# EAGLE design Qwiic Twist (EAGLE 9.4.0)
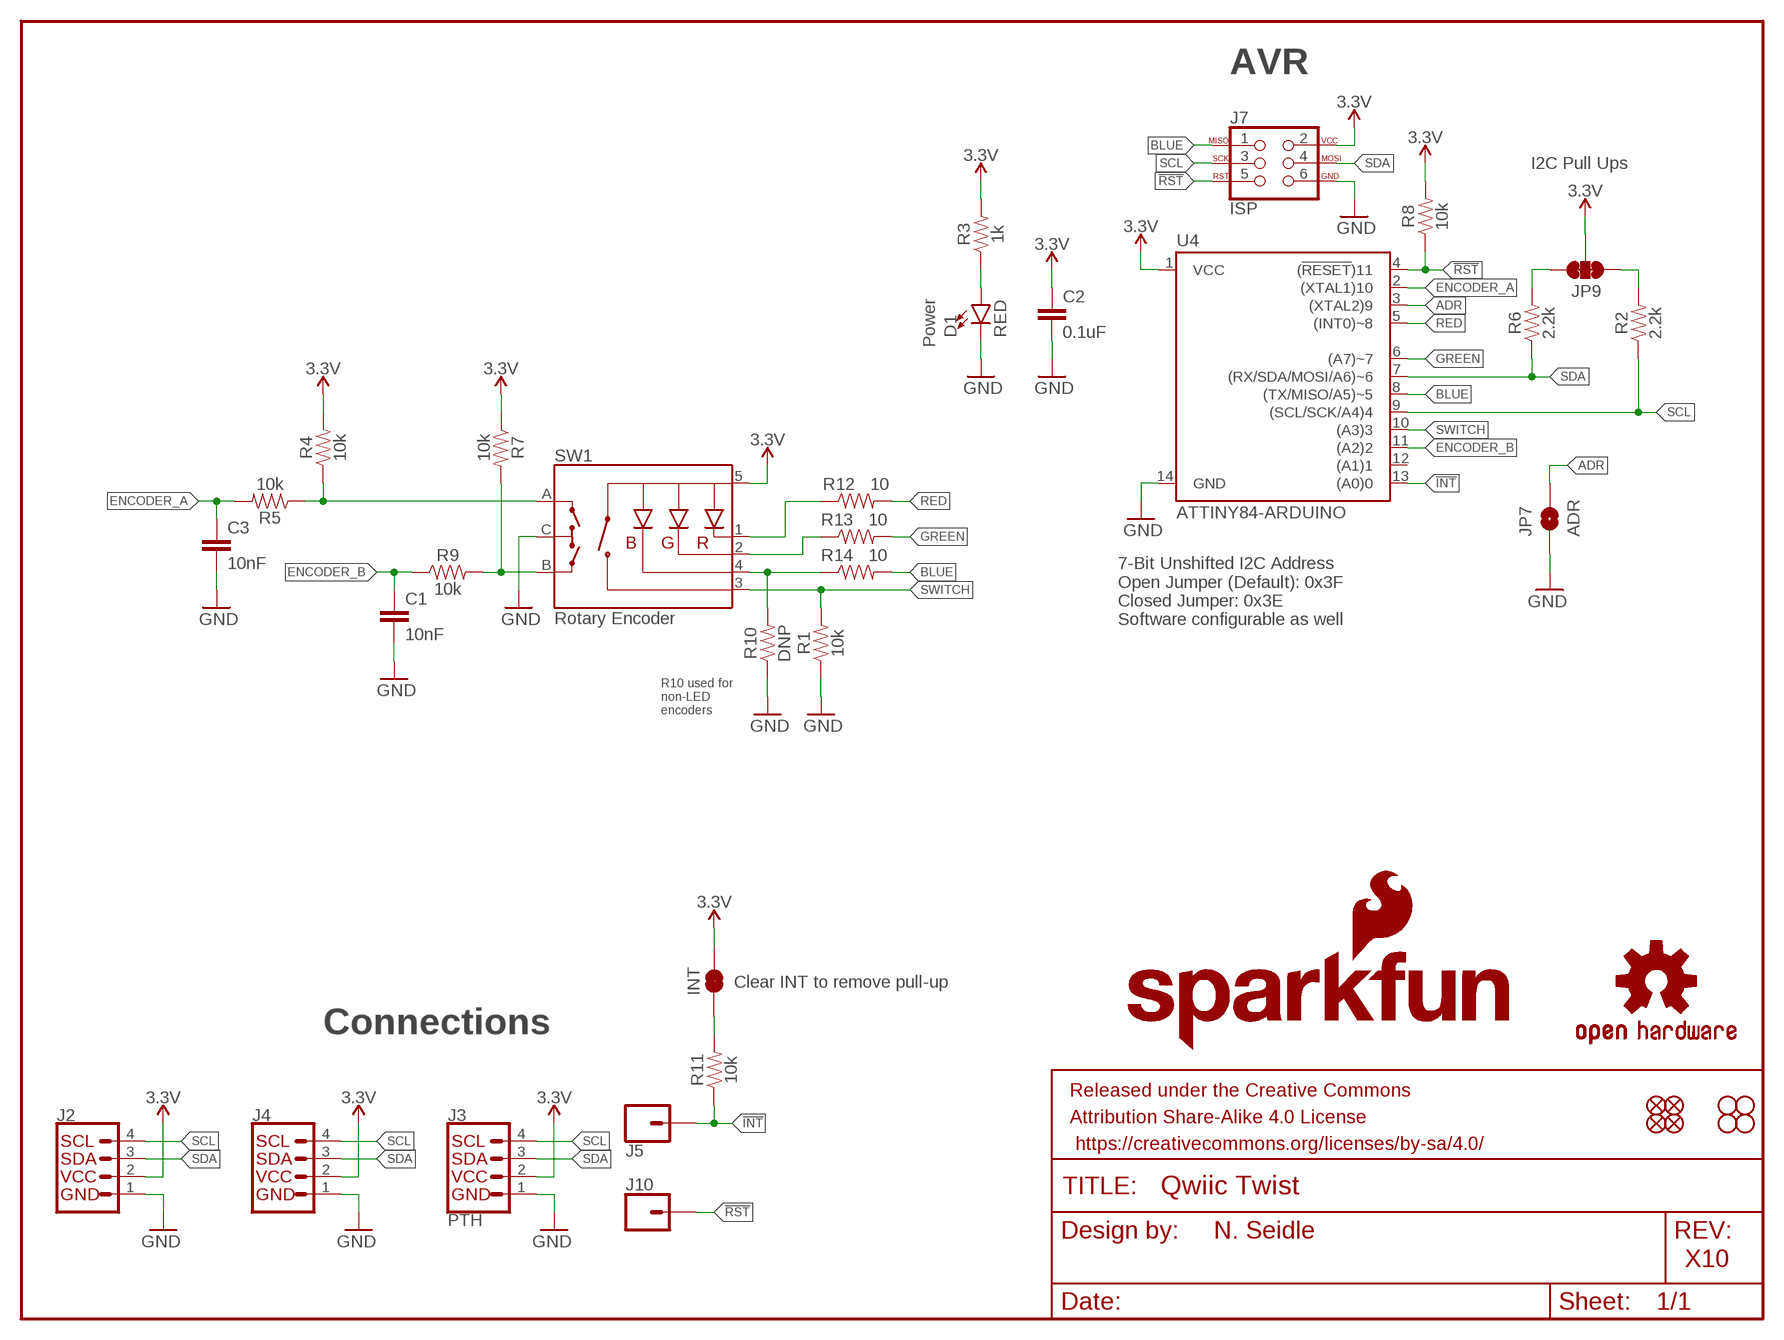
[diagram p0: schematic, sheet 1]

## Parts
C1  10nF  10NF-0603-50V-10%  [0603]
C2  0.1uF  0.1UF-0603-25V-(+80/-20%)  [0603]
C3  10nF  10NF-0603-50V-10%  [0603]
D1  RED  LED-RED0603  [LED-0603]
FRAME1  FRAME-LETTER  [CREATIVE_COMMONS]
INT  JUMPER-SMT_2_NC_TRACE_SILK  [SMT-JUMPER_2_NC_TRACE_SILK]
J2  QWIIC_CONNECTORJS-1MM  [1X04_1MM_RA]
J3  PTH  I2C_STANDARD_NO_SILK  [1X04_NO_SILK]
J4  QWIIC_CONNECTORJS-1MM  [1X04_1MM_RA]
J5  CONN_01PTH_NO_SILK_YES_STOP  [1X01_NO_SILK]
J7  ISP  AVR_SPI_PROG_3X2TESTPOINTS  [2X3_TEST_POINTS]
J10  CONN_01PTH_NO_SILK_YES_STOP  [1X01_NO_SILK]
JP1  FIDUCIALUFIDUCIAL  [MICRO-FIDUCIAL]
JP2  FIDUCIALUFIDUCIAL  [MICRO-FIDUCIAL]
JP3  STAND-OFF  [STAND-OFF]
JP4  STAND-OFF  [STAND-OFF]
JP5  FIDUCIALUFIDUCIAL  [MICRO-FIDUCIAL]
JP6  FIDUCIALUFIDUCIAL  [MICRO-FIDUCIAL]
JP7  ADR  JUMPER-SMT_2_NO_SILK  [SMT-JUMPER_2_NO_SILK]
JP9  JUMPER-SMT_3_2-NC_TRACE_SILK  [SMT-JUMPER_3_2-NC_TRACE_SILK]
JP11  STAND-OFF  [STAND-OFF]
JP13  STAND-OFF  [STAND-OFF]
LOGO1  OSHW-LOGOMINI  [OSHW-LOGO-MINI]
LOGO2  SFE_LOGO_NAME_FLAME.1_INCH  [SFE_LOGO_NAME_FLAME_.1]
LOGO3  SFE_LOGO_FLAME.1EXP  [SFE_LOGO_FLAME_COPPER_EXPOSED_.1]
R1  10k  10KOHM-0603-1/10W-1%  [0603]
R2  2.2k  2.2KOHM-0603-1/10W-1%  [0603]
R3  1k  1KOHM-0603-1/10W-1%  [0603]
R4  10k  10KOHM-0603-1/10W-1%  [0603]
R5  10k  10KOHM-0603-1/10W-1%  [0603]
R6  2.2k  2.2KOHM-0603-1/10W-1%  [0603]
R7  10k  10KOHM-0603-1/10W-1%  [0603]
R8  10k  10KOHM-0603-1/10W-1%  [0603]
R9  10k  10KOHM-0603-1/10W-1%  [0603]
R10  DNP  10KOHM-0603-1/10W-1%  [0603]
R11  10k  10KOHM-0603-1/10W-1%  [0603]
R12  10  10OHM-0603-1/10W-1%  [0603]
R13  10  10OHM-0603-1/10W-1%  [0603]
R14  10  10OHM-0603-1/10W-1%  [0603]
SW1  Rotary Encoder  ENCODER-RGB-SWITCHKIT  [ENCODER_LED_3_KIT]
U4  ATTINY84-ARDUINO  [SO14]

## Nets
3.3V: C2.1 INT.2 J2.2 J3.2(VCC) J4.2 J7.2 JP9.2 R3.2 R4.2 R7.1 R8.2 SW1.5(+) U4.1(VCC)
!INT: J5.1 R11.1 U4.13((A0)0)
!RST: J7.5 J10.1 R8.1 U4.4((!RESET!)11)
A: R4.1 R5.1 SW1.A
ADR: JP7.2 U4.3((XTAL2)9)
B: R7.2 R9.2 SW1.B
BLUE: J7.1 R14.2 U4.8((TX/MISO/A5)~5)
BLUE_RAW: R10.2 R14.1 SW1.4(-B)
ENCODER_A: C3.1 R5.2 U4.2((XTAL1)10)
ENCODER_B: C1.1 R9.1 U4.11((A2)2)
GND: C1.2 C2.2 C3.2 D1.C J2.1 J3.1(GND) J4.1 J7.6 JP7.1 R1.1 R10.1 SW1.C U4.14(GND)
GREEN: R13.2 U4.6((A7)~7)
GREEN_RAW: R13.1 SW1.2(-G)
INT_R: INT.1 R11.2
N$3: D1.A R3.1
RED: R12.2 U4.5((INT0)~8)
RED_RAW: R12.1 SW1.1(-R)
SCL: J2.4 J3.4(SCL) J4.4 J7.3 R2.1 U4.9((SCL/SCK/A4)4)
SCL_PU1: JP9.1 R2.2
SDA: J2.3 J3.3(SDA) J4.3 J7.4 R6.1 U4.7((RX/SDA/MOSI/A6)~6)
SDA_PU1: JP9.3 R6.2
SWITCH: R1.2 SW1.3(SW) U4.10((A3)3)
Unconnected: U4.12((A1)1)

## Notes on the sheet
- AVR
- I2C Pull Ups
- Power
- 7-Bit Unshifted I2C Address
  Open Jumper (Default): 0x3F
  Closed Jumper: 0x3E
  Software configurable as well
- R10 used for 
  non-LED 
  encoders
- Clear INT to remove pull-up
- Connections
- N. Seidle
- X10

## Library data of the parts
C1 C3 = SparkFun-Capacitors:10NF: 0.01uF/10nF/10,000pF ceramic capacitors A capacitor is a passive two-terminal electrical component used to store electrical energy temporarily in an electric field. CAP-09321; PROD_ID: CAP-00867
C2 = SparkFun-Capacitors:0.1UF: 0.1µF ceramic capacitors A capacitor is a passive two-terminal electrical component used to store electrical energy temporarily in an electric field.; PROD_ID: CAP-00810
D1 = SparkFun-LED:LED-RED: Red SMD LED Used in manufacturing of most products at SparkFun Packages: 0603 - SMD 0603 package [Product Link] <http://docs.avagotech.com/docs/AV02-0551EN> 0603 SMART - SMD 0603 SMART package ( more efficient and expensive)[Product Link] <http://www.osram-os.com/Graphics/XPic2/00077099_0.pdf> 1206 - SMD1206 package [Product Link] <https://www.sparkfun.com/datasheets/DevTools/LilyPad/Q150OVS4.pdff> SparkFun Products: Pro Mini 328 -5V <https://www.sparkfun.com/products/821> RedBoard <https://www.sparkfun.com/products/12757> IOIO-OTG <https://www.sparkfun.com/products/13613>; PROD_ID: DIO-00819
FRAME1 = SparkFun-Aesthetics:FRAME-LETTER: Schematic Frame - Letter Standard 8.5x11 US Letter frame
INT = SparkFun-Jumpers:JUMPER-SMT_2_NC_TRACE: Normally closed trace jumper This jumper has a trace between two pads so it's normally closed (NC). Use a razor knife to open the connection. For best results follow the IPC guidelines for cutting traces: Cutout at least 0.063 mm (0.005 in). Remove all loose material to clean up the cut area. Seal the cut with an approved epoxy. Reapply solder to reclose the connection.
J2 J4 = SparkFun-Connectors:QWIIC_CONNECTOR: SparkFun I2C Standard Qwiic Connector An SMD 1mm pitch JST connector makes it easy and quick (get it? Qwiic?) to connect I2C devices to each other. The Qwiic system <http://www.sparkfun.com/qwiic> enables fast and solderless connection between popular platforms and various sensors and actuators. We carry 200mm <https://www.sparkfun.com/products/14204>, 100mm <https://www.sparkfun.com/products/14205>, 50mm <https://www.sparkfun.com/products/14206>, and breadboard friendly <https://www.sparkfun.com/products/14207> Qwiic cables. We also offer 10 pcs strips <https://www.sparkfun.com/products/14323> the SMD connectors.; PROD_ID: CONN-13694
J3 = SparkX:I2C_STANDARD: SparkFun I2C Standard Pinout Header SparkFun has standardized on a pinout for all I2C based sensor breakouts. This pinout allows I2C boards to be plugged directly into the headers on Arduino Uno compatible boards, and to be daisy chained easily. Example SparkFun Products: SparkFun Atmospheric Sensor Breakout - BME280 <https://www.sparkfun.com/products/13676> SparkFun Altitude/Pressure Sensor Breakout - MPL3115A2 <https://www.sparkfun.com/products/11084> SparkFun TOF Range Finder Sensor - VL6180 <https://www.sparkfun.com/products/12785>
J5 J10 = SparkFun-Connectors:CONN_01: Single connection point. Often used as Generic Header-pin footprint for 0.1 inch spaced/style header connections On any of the 0.1 inch spaced packages, you can populate with these: Break Away Headers - Straight <https://www.sparkfun.com/products/116> (PRT-00116) Break Away Male Headers - Right Angle <https://www.sparkfun.com/products/553> (PRT-00553) Female Headers <https://www.sparkfun.com/products/115> (PRT-00115) Break Away Headers - Machine Pin <https://www.sparkfun.com/products/117> (PRT-00117) Break Away Female Headers - Swiss Machine Pin <https://www.sparkfun.com/products/743> (PRT-00743) This device is also useful as a general connection point to wire up your design to another part of your project. Our various solder wires solder well into these plated through hole pads. Hook-Up Wire - Assortment (Stranded, 22 AWG) <https://www.sparkfun.com/products/11375> (PRT-11375) Hook-Up Wire - Assortment (Solid Core, 22 AWG) <https://www.sparkfun.com/products/11367> (PRT-11367) View the entire wire category on our website here <https://www.sparkfun.com/categories/141> Special notes: SMTSO-256-ET is a "flush mount" nut for a 4-40 screw. We mostly use this on specialty testbeds; it is a nice way to connect hardware to your PCB at an adjustable hieght. Also note, the SNAP packages are for using a snappable style connector. We sell a baggie of snaps and they are also used on two LilyPad designs: Snap Assortment - 30 pack (male and female) <https://www.sparkfun.com/products/11347> (DEV-11347) LilyPad Arduino SimpleSnap <https://www.sparkfun.com/products/10941> (DEV-10941) LilyPad SimpleSnap Protoboard <https://www.sparkfun.com/products/10940> (DEV-10940)
J7 = SparkFun-Connectors:AVR_SPI_PROG_3X2: AVR ISP 6 Pin This is the reduced ISP connector for AVR programming. Common on Arduino. This footprint will take up less PCB space and can be used with a 10-pin to 6-pin adapter such as SKU: BOB-08508 **Special note about "TEST_POINT" package. The stop mask is on the top side, so if you want your programming test points to be on the bottom of your board, make sure to place this package on the bottom side of the board. This also ensure that the orientation to program from the bottom side will be correct. SparkFun Products: SparkFun ISP Pogo Adapter <https://www.sparkfun.com/products/11591> - NS Tiny AVR Programmer <https://www.sparkfun.com/products/11801> -PTH
JP1 JP2 JP5 JP6 = SparkFun:FIDUCIAL: Fiducial Alignment Points Various fiducial points for machine vision alignment.
JP3 JP4 JP11 JP13 = SparkFun:STAND-OFF: Stand Off This is the mechanical footprint for a #4 phillips button head screw. Use the keepout ring to avoid running the screw head into surrounding components. SKU : PRT-00447
JP7 = SparkFun-Jumpers:JUMPER-SMT_2_NO: Normally open jumper This jumper has two pads in close proximity to each other. Apply solder to close the connection. Round pads are easier to solder for beginners, but are a lot larger. SparkFun Product that uses the round pads: SparkFun EL Sequencer <https://www.sparkfun.com/products/12781>
JP9 = SparkFun-Jumpers:JUMPER-SMT_3_2-NC_TRACE: Normally closed trace jumper (2 of 2 connections) This jumper has a trace between all three pads so they are normally closed (NC). Use a razor knife to open the connection(s). For best results follow the IPC guidelines for cutting traces: Cutout at least 0.063 mm (0.005 in). Remove all loose material to clean up the cut area. Seal the cut with an approved epoxy. Reapply solder to reclose the connection(s).
LOGO1 = SparkFun-Aesthetics:OSHW-LOGO: Open-Source Hardware (OSHW) Logo This logo indicates the piece of hardware it is found on incorporates a OSHW license and/or adheres to the definition of open source hardware found here: http://freedomdefined.org/OSHW
LOGO2 = SparkFun-Aesthetics:SFE_LOGO_NAME_FLAME: SparkFun Font Logo w/ Flame This is the SparkFun full logo. The logo on the schematic will always be the same size; the package variant is the height of the flame part of the logo. Default layer for the logo on the board is tSilk.
LOGO3 = SparkFun-Aesthetics:SFE_LOGO_FLAME: SparkFun Flame Logo This is the SparkFun flame logo. The logo on the schematic will always be the same size; the package variant is the height of the flame. Default layer for the logo on the board is tSilk.
R1 R4 R5 R7-R9 R11 = SparkFun-Resistors:10KOHM: 10kΩ resistor A resistor is a passive two-terminal electrical component that implements electrical resistance as a circuit element. Resistors act to reduce current flow, and, at the same time, act to lower voltage levels within circuits. - Wikipedia; PROD_ID: RES-00824
R2 R6 = SparkFun-Resistors:2.2KOHM: 2.2kΩ resistor A resistor is a passive two-terminal electrical component that implements electrical resistance as a circuit element. Resistors act to reduce current flow, and, at the same time, act to lower voltage levels within circuits. - Wikipedia; PROD_ID: RES-08272
R3 = SparkFun-Resistors:1KOHM: 1kΩ resistor A resistor is a passive two-terminal electrical component that implements electrical resistance as a circuit element. Resistors act to reduce current flow, and, at the same time, act to lower voltage levels within circuits. - Wikipedia; PROD_ID: RES-07856
R10 = SparkFun-Resistors:10KOHM: 10kΩ resistor A resistor is a passive two-terminal electrical component that implements electrical resistance as a circuit element. Resistors act to reduce current flow, and, at the same time, act to lower voltage levels within circuits. - Wikipedia; PROD_ID: RES-00824; VALUE: 10k
R12-R14 = SparkFun-Resistors:10OHM: 10Ω resistor A resistor is a passive two-terminal electrical component that implements electrical resistance as a circuit element. Resistors act to reduce current flow, and, at the same time, act to lower voltage levels within circuits. - Wikipedia; PROD_ID: RES-12581
SW1 = SparkFun-Switches:ENCODER-RGB-SWITCH: Illuminated Rotary Encoder w/ RGB LED and select switch Encoders rotate similarly to potentiometers, but they’re different from potentiometers in that an encoder has full rotation without limits. They output gray code so that you can tell how much and in which direction the encoder has been turned. This encoder includes an RGB LED and a push-down select switch. Part #: Top Up EC12PLRGBSDVBF-D <http://top-up.so-buy.com/front/bin/ptdetail.phtml?Part=EC12PLRGBSDVBF-D> SparkFun Products Rotary Encoder - Illuminated (RGB) <https://www.sparkfun.com/products/10982> (COM-10982); PROD_ID: RES-10859; SF_SKU: COM-10982
U4 = SparkFun-IC-Microcontroller:ATTINY84-ARDUINO; PROD_ID: IC-14155

## Net classes
1 3.3V: width 0.152 mm

## Board
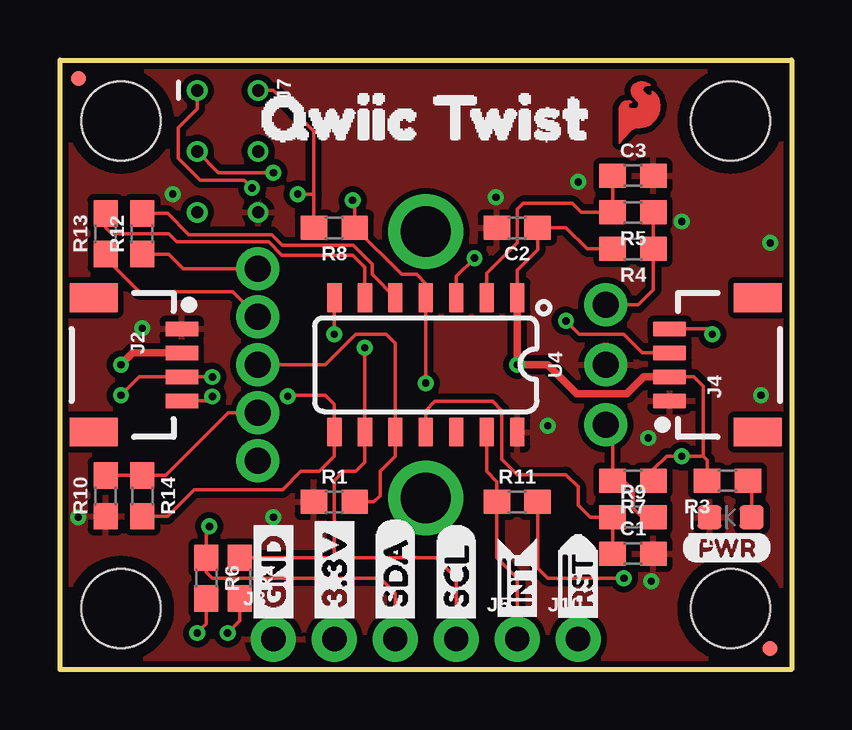
[diagram p1: board, top side]
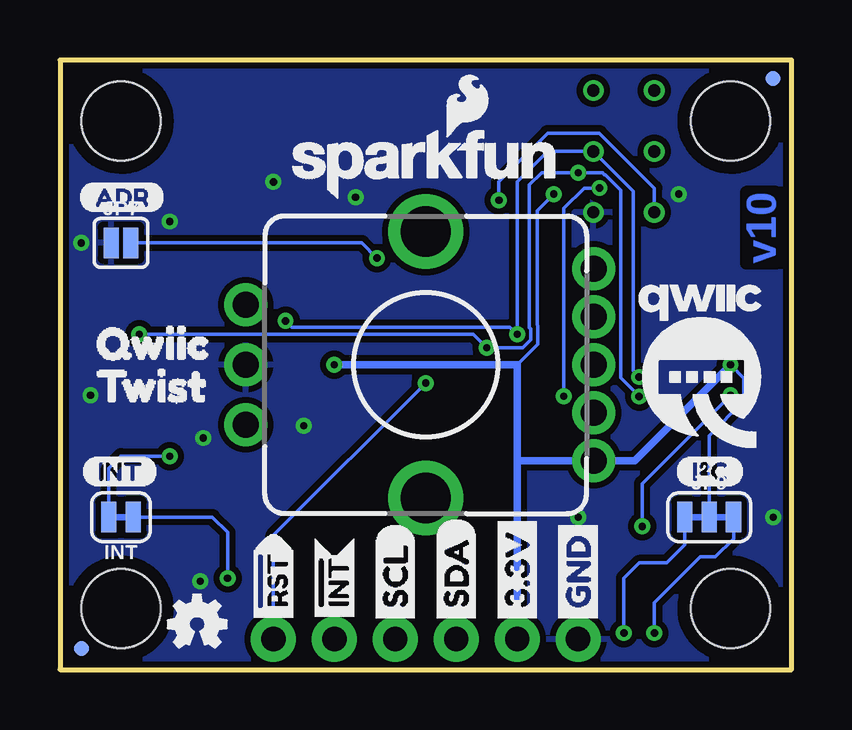
[diagram p2: board, bottom side, seen from below]

Size 30.48 x 25.4 mm. Coordinates in mm from the lower left corner, seen from the top.
Outline: 0,0 0,25.4 30.48,25.4 30.48,0 0,0
Copper layers (1*16): Top 0.035mm / dielectric 1.5mm / Bottom 0.035mm
Design rules "SparkFun-2-layer-PCBWay-LIMIT *": minimum track width 6mil, minimum drill 0.3mm, track to track 6mil, track to pad 6mil, pad to pad 6mil, via to via 6mil, smd to smd 6mil, copper to edge 6mil, drill to drill 6mil, minimum pad ring 7mil, minimum via ring 7mil, stop-mask expansion 4mil, vias tented up to drill 25mil, thermal gap 10mil

### Footprints (pad centres in the part's own frame; a part is rotated, then mirrored left to right if it is on the bottom)
0603 = smd 1.1 x 1: 1 -0.85,0; 2 0.85,0
LED-0603 = smd 1 x 1: A -0.877,0; C 0.877,0
SMT-JUMPER_2_NC_TRACE_SILK = smd 0.635 x 1.27: 1 -0.508,0; 2 0.508,0
1X04_1MM_RA = smd 0.6 x 1.35: 1 -1.5,0; 2 -0.5,0; 3 0.5,0; 4 1.5,0 | smd 1.2 x 2: NC1 2.8,-3.675; NC2 -2.8,-3.675
1X04_NO_SILK = drill 1.016 pad 1.88: 1 0,0; 2 2.54,0; 3 5.08,0; 4 7.62,0
1X01_NO_SILK = drill 1.016 pad 1.88: 1 0,0
2X3_TEST_POINTS = drill 0.508: 1 -2.54,-1.27; 2 -2.54,1.27; 3 0,-1.27; 4 0,1.27; 5 2.54,-1.27; 6 2.54,1.27
MICRO-FIDUCIAL = smd 0.635 x 0.635: 1 0,0
STAND-OFF = hole 3.302: 0,0
SMT-JUMPER_2_NO_SILK = smd 0.635 x 1.27: 1 -0.406,0; 2 0.406,0
SMT-JUMPER_3_2-NC_TRACE_SILK = smd 0.635 x 1.27: 1 -1.016,0; 2 0,0; 3 1.016,0
ENCODER_LED_3_KIT = drill 1.1 pad 1.778: 1 -4,7; 2 -2,7; 3 0,7; 4 2,7; 5 4,7 | drill 1.1 pad 1.8: A -2.5,-7.5; B 2.5,-7.5; C 0,-7.5 | drill 2.1: M1 -5.55,0; M2 5.55,0
SO14 = smd 0.6 x 1.2: 1 -3.175,-2.8; 2 -1.905,-2.8; 3 -0.635,-2.8; 4 0.635,-2.8; 5 1.905,-2.8; 6 3.175,-2.8; 7 4.445,-2.8; 8 4.445,2.8; 9 3.175,2.8; 10 1.905,2.8; 11 0.635,2.8; 12 -0.635,2.8; 13 -1.905,2.8; 14 -3.175,2.8

### Placement (x,y rotation side)
C1  23.88,4.83 0 top
C2  19.05,18.41 180 top
C3  23.88,20.57 0 top
D1  27.94,6.35 180 top
FRAME1  -20.32,-17.78 0 top  (outside the outline)
INT  27.94,6.35 180 bottom
J2  5.08,12.7 270 top
J3  8.89,1.27 0 top
J4  25.4,12.7 90 top
J5  19.05,1.27 0 top
J7  6.99,21.59 270 top
J10  21.59,1.27 0 top
JP1  0.76,24.64 0 bottom
JP2  29.59,0.89 0 top
JP3  2.54,22.86 0 top
JP4  27.94,22.86 0 top
JP5  29.59,0.89 0 bottom
JP6  0.76,24.64 0 top
JP7  27.94,17.78 0 bottom
JP9  3.43,6.35 0 bottom
JP11  2.54,2.54 0 top
JP13  27.94,2.54 0 top
LOGO1  24.77,1.91 0 bottom
LOGO2  15.24,21.08 0 bottom
LOGO3  24.13,23.24 0 top
R1  11.43,6.99 0 top
R2  7.49,3.81 270 top
R3  27.81,7.87 180 top
R4  23.88,17.53 180 top
R5  23.88,19.05 180 top
R6  6.1,3.81 270 top
R7  23.88,7.87 180 top
R8  11.43,18.41 180 top
R9  23.88,6.35 0 top
R10  1.91,7.24 90 top
R11  19.05,6.99 0 top
R12  3.43,18.16 90 top
R13  1.91,18.16 90 top
R14  3.43,7.24 270 top
SW1  15.24,12.7 270 bottom
U4  15.88,12.7 180 top
U$1  [QWIIC1]  30.1,13.59 0 bottom
U$2  [INT0]  29.59,8.26 0 bottom
U$3  [GND1]  8.89,1.65 90 bottom
U$4  [3#3V2]  11.43,1.65 90 bottom
U$5  [SDA8]  13.97,1.65 90 bottom
U$6  [SCL9]  16.51,1.65 90 bottom
U$7  [RST#-[>]  21.59,1.52 90 top
U$8  [I_SUPER2_C-()-03]  4.83,8.26 0 bottom
U$9  [INT#-[<]  19.05,1.52 90 top
U$11  [INT#-[<]  19.05,1.52 90 bottom
U$12  [TWIST2]  30.1,11.81 0 bottom
U$14  [QWIIC_TWIST1]  6.73,22.99 0 top
U$16  [RST#-[>]  21.59,1.52 90 bottom
U$17  [PWR-()-03]  25.91,5.08 0 top
U$18  [ADR-()-03]  29.72,19.68 0 bottom
U$21  [3#3V2]  11.43,1.65 90 top
U$22  [GND1]  8.89,1.65 90 top
U$26  [SCL9]  16.51,1.65 90 top
U$27  [SDA8]  13.97,1.65 90 top
U$47  [QWIIC-LOGO-MEDIUM]  3.81,12.7 0 bottom

### Tracks (layer width: path | path; a pad name or v marks a point on that pad's centre or on a via)
3.3V  (via drill 0.3)
  Top 0.152: U4.1 19.05,16.64 19.9,17.49 C2.1 21.08,18.41 21.97,17.53 R4.2 | J7.2 8.89,24.13 10.58,22.44 10.58,19.81 | R8.2 10.58,19.81 | R7.1 24.73,8.34 25.27,8.89 v25.91,8.89 26.8,8.89 | J4.2 26.41,12.2 26.8,11.81 26.8,8.89 | v9.91,19.81 10.58,19.81 | R3.2 26.96,8.72 26.8,8.89
  Top 0.305: J4.2 24.32,12.2 23.62,11.49 21.52,11.49 20.32,12.7 v19.05,12.7 U4.1 | J2.2 3.04,13.2 v2.54,12.7
  Bottom 0.152: v9.91,19.81 10.6,19.11 10.6,14.37 10.57,14.33 10.57,13.56 11.43,12.7 | INT.2 28.45,8.38 27.94,8.89 v25.91,8.89 | JP9.2 3.43,9.75 1.98,11.2 1.98,12.14 v2.54,12.7
  Bottom 0.305: 8.38,8.7 SW1.5 | SW1.5 6.54,8.7 v2.54,12.7 | J3.2 11.43,8.64 | 11.43,8.64 11.37,8.7 SW1.5 | v19.05,12.7 11.43,12.7 11.43,8.64
!INT
  Top 0.152: J5.1 19.05,3.81 18.2,4.66 R11.1 18.2,7.83 17.78,8.26 U4.13
!RST  (via drill 0.3)
  Top 0.152: v12.19,19.56 12.28,19.47 R8.1 14.23,16.46 14.86,16.46 15.24,16.08 U4.4 v15.24,11.94
  Bottom 0.152: v12.19,19.56 12.19,20.32 10.16,22.35 8,22.35 5.71,20.07 J7.5 | J10.1 21.59,5.59 v15.24,11.94
A
  Top 0.152: R5.1 R4.1 24.73,15.84 24.09,15.2 SW1.A
ADR  (via drill 0.3)
  Top 0.152: U4.3 16.51,16.38 v17.27,17.14
  Bottom 0.152: JP7.2 17.91,17.78 v17.27,17.14
B
  Top 0.152: R9.2 24.26,6.35 23.88,6.73 23.88,7.49 23.5,7.87 R7.2 23.03,9.91 SW1.B
BLUE  (via drill 0.3)
  Top 0.152: v9.49,11.39 9.53,11.43 11.05,11.43 11.43,11.05 U4.8 11.43,8.89 10.79,8.26 10.03,8.26 9.27,7.49 5.59,7.49 4.48,6.39 R14.2 | v8,20.07 7.67,20.4 5.85,20.4 4.93,21.32 4.93,22.58 5.71,23.37 J7.1
  Bottom 0.152: v9.49,11.39 9.49,19.21 8.64,20.07 v8,20.07
BLUE_RAW
  Top 0.152: R10.2 R14.1 4.41,8.09 7.02,10.7 SW1.4
ENCODER_A
  Top 0.152: C3.1 R5.2 21.72,19.05 21.34,19.43 19.3,19.43 19.05,19.18 19.05,17.78 17.78,16.51 U4.2
ENCODER_B
  Top 0.152: C1.1 R9.1 22.1,6.35 21.59,6.86 21.59,7.62 21.08,8.13 19.05,8.13 18.41,8.76 18.41,10.79 18.03,11.18 15.62,11.18 15.24,10.79 U4.11
GND  (via drill 0.3)
  other vias: 0.76,6.35 3.43,14.22 24.51,9.65 24.64,3.68 25.91,18.67 21.59,20.32 29.59,17.78 18.16,19.68 20.32,10.16 8.89,6.35 4.7,19.81 29.21,11.43
  pour Bottom (isolate 0.254, rank 2): 0,0 0,25.4 30.48,25.4 30.48,0
  pour Top (isolate 0.254, rank 2): 0,0 0,25.4 30.48,25.4 30.48,0
GREEN
  Top 0.152: U4.6 12.7,16.76 12.19,17.27 9.25,17.27 8.7,17.82 4.87,17.82 4.52,18.16 2.16,18.16 1.91,18.41 R13.2
GREEN_RAW
  Top 0.152: R13.1 1.91,17.14 3.3,15.75 7.19,15.75 SW1.2
INT_R  (via drill 0.3)
  Top 0.152: R11.2 19.9,4.23 20.32,3.81 v23.5,3.81
  Bottom 0.152: v23.5,3.81 23.5,5.71 24.13,6.35 INT.1
N$3
  Top 0.152: R3.1 28.82,7.72 D1.A
RED
  Top 0.152: U4.5 13.01,16.46 13.01,16.89 12.21,17.69 9.27,17.69 8.83,18.12 5.37,18.12 4.48,19.01 R12.2
RED_RAW
  Top 0.152: SW1.1 5.14,16.7 4.53,17.31 R12.1
SCL  (via drill 0.3)
  Top 0.152: J2.4 6.17,11.2 v6.35,11.38 | J4.4 26.95,14.2 v27.18,13.97 | v12.7,13.41 U4.9 12.7,8.64 12.32,8.26 11.81,8.26 11.43,7.87 11.43,4.66 | R2.1 11.43,4.66 | 11.43,4.66 15.66,4.66 16.51,3.81 J3.4 | v8.89,20.7 6.6,20.7 J7.3
  Bottom 0.152: v27.18,13.97 13.26,13.97 v12.7,13.41 11.2,13.41 10.87,13.74 10.87,14.2 10.92,14.25 10.92,20.19 10.41,20.7 v8.89,20.7 7.87,20.7 7.8,20.62 7.77,20.62 7.12,19.98 7.12,12.15 v6.35,11.38
SCL_PU1  (via drill 0.3)
  Top 0.152: R2.2 7.49,2.03 v6.99,1.52
  Bottom 0.152: JP9.1 4.45,5.21 5.21,4.45 6.35,4.45 6.99,3.81 v6.99,1.52
SDA  (via drill 0.3)
  Top 0.152: v6.35,12.19 v6.34,12.2 J2.3 3.31,12.2 v2.54,11.43 | J4.3 24.27,13.2 23.5,13.97 21.64,13.97 v21.08,14.53 | v11.43,13.97 U4.7 | J3.3 13.97,3.17 13.34,3.81 6.35,3.81 6.1,4.06 R6.1 6.1,5.84 v6.22,5.97
  Bottom 0.152: v6.35,12.19 6.6,12.45 6.6,19.94 J7.4 10.16,21.59 11.43,20.32 v11.43,13.97 11.73,14.28 20.83,14.28 v21.08,14.53 | v6.22,5.97 6.22,7.75 v2.54,11.43
SDA_PU1  (via drill 0.3)
  Top 0.152: R6.2 6.1,1.91 v5.71,1.52
  Bottom 0.152: JP9.3 2.41,5.46 3.17,4.7 3.81,4.7 5.71,2.79 v5.71,1.52
SWITCH
  Top 0.152: R1.2 13.08,6.99 13.34,7.24 13.34,8.26 13.97,8.89 U4.10 13.97,13.59 13.59,13.97 12.32,13.97 11.05,12.7 SW1.3

### Text on the board
Bottom: v10
Measures: All dimensions in inches